# EAGLE schematic moist_probe_conv_0.1 (EAGLE 7.4.0)
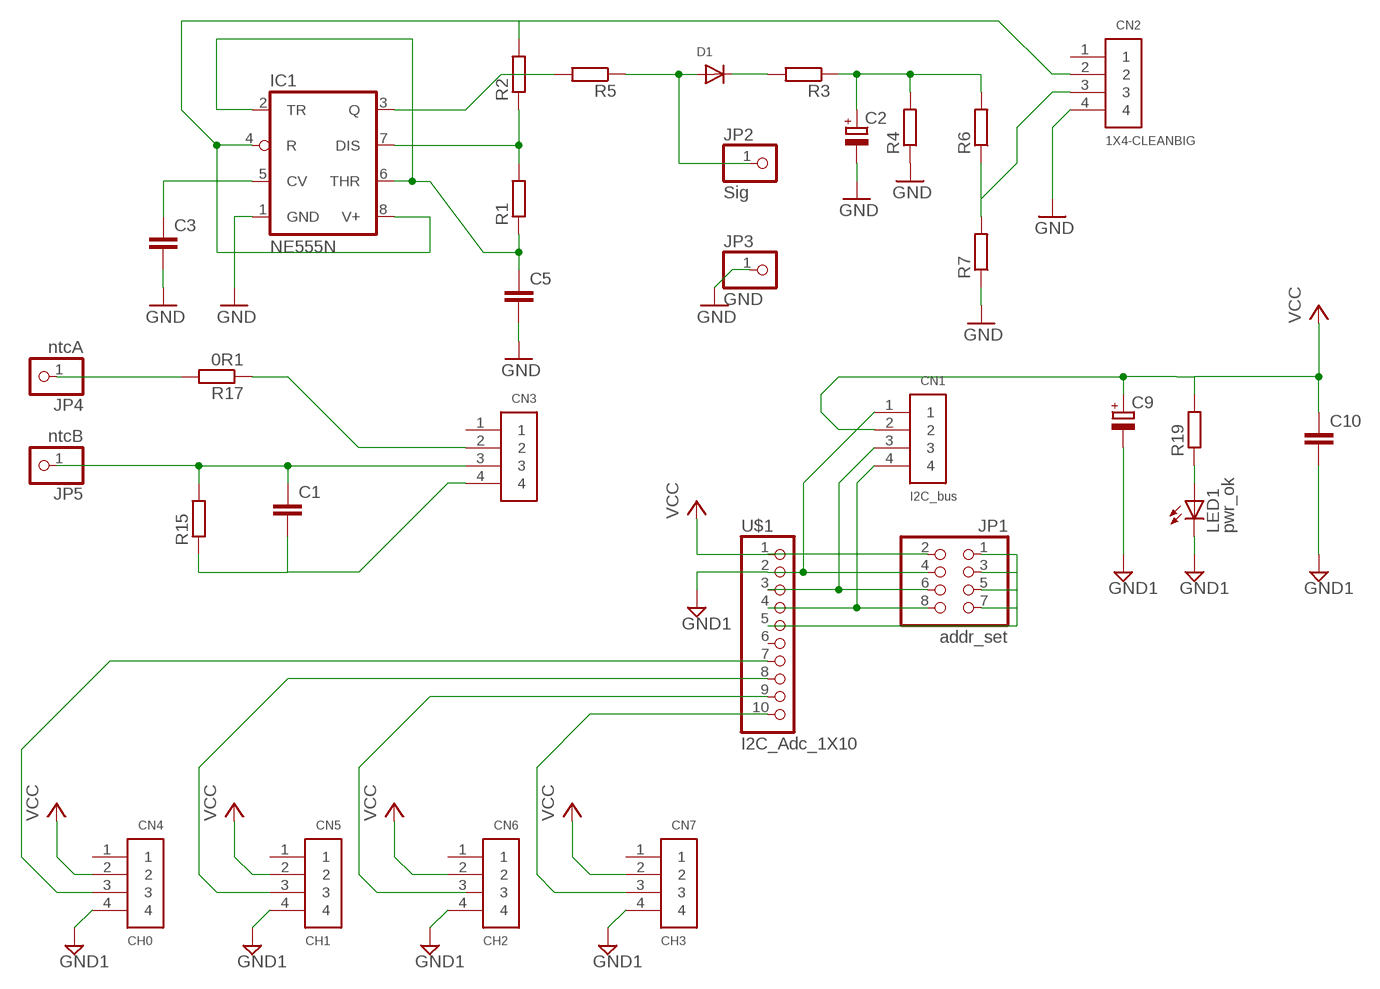
[diagram p0: schematic, sheet 1]

## Parts
C1  C-EU050-025X075  [C050-025X075]
C2  CPOL-EUE2,5-6E  [E2,5-6E]
C3  C-EU025-025X050  [C025-025X050]
C5  C-EU050-025X075  [C050-025X075]
C9  CPOL-EUE2.5-7  [E2,5-7]
C10  C-EU050-025X075  [C050-025X075]
CN1  I2C_bus  1X4-CLEANBIG  [1X04-CLEANBIG]
CN2  1X4-CLEANBIG  [1X04-CLEANBIG]
CN3  1X4-CLEANBIG  [1X04-CLEANBIG]
CN4  CH0  1X4-CLEANBIG  [1X04-CLEANBIG]
CN5  CH1  1X4-CLEANBIG  [1X04-CLEANBIG]
CN6  CH2  1X4-CLEANBIG  [1X04-CLEANBIG]
CN7  CH3  1X4-CLEANBIG  [1X04-CLEANBIG]
D1  DIODEDO-1N4148  [DO-1N4148]
IC1  NE555N  [DIL08-ROUND]
JP1  addr_set  PINHD-2X4  [2X04]
JP2  Sig  PINHD-1X1  [1X01]
JP3  GND  PINHD-1X1  [1X01]
JP4  ntcA  PINHD-1X1  [1X01]
JP5  ntcB  PINHD-1X1  [1X01]
LED1  pwr_ok  LED3MM  [LED3MM]
R1  R-EU_0204/2V  [0204V]
R2  R-EU_0204/2V  [0204V]
R3  R-EU_0204/2V  [0204V]
R4  R-EU_0204/2V  [0204V]
R5  R-EU_0204/7  [0204/7]
R6  R-EU_0204/2V  [0204V]
R7  R-EU_0204/2V  [0204V]
R15  R-EU_0204/7  [0204/7]
R17  0R1  R-EU_0204/7  [0204/7]
R19  R-EU_0204/2V  [0204V]
U$1  I2C_Adc_1X10  PINHD-1X10  [1X10-BIG]

## Nets
GND: C2.- C3.2 C5.2 CN2.4 IC1.1(GND) JP3.1 R4.1 R7.1
GND1: C9.- C10.2 CN1.1 CN4.4 CN5.4 CN6.4 CN7.4 JP1.4 LED1.K(C) U$1.2
N$1: CN1.3 JP1.6 U$1.3
N$2: C3.1 IC1.5(CV)
N$3: C5.1 IC1.2(TR) IC1.6(THR) R1.1
N$4: IC1.7(DIS) R1.2 R2.1
N$5: CN2.3 R6.1 R7.2
N$6: CN3.2 R17.1
N$7: D1.C R3.2
N$9: D1.A JP2.1 R5.1
N$10: IC1.3(Q) R5.2
N$11: C1.2 CN3.4 R15.1
N$12: C2.+ R3.1 R4.2 R6.2
N$14: CN7.3 U$1.10
N$15: U$1.9
N$16: CN5.3 U$1.8
N$17: CN4.3 U$1.7
N$18: CN1.4 JP1.8 U$1.4
N$19: C9.+ CN1.2
N$21: C1.1 CN3.3 JP5.1 R15.2
N$22: LED1.A R19.1
N$26: JP4.1 R17.2
N$28: JP1.1 JP1.3 JP1.5 JP1.7 U$1.5
N$32: CN2.2 IC1.4(R) IC1.8(V+) R2.2
VCC: C10.1 CN4.2 CN5.2 CN6.2 CN7.2 JP1.2 R19.2 U$1.1
Unconnected: CN2.1 CN3.1 CN4.1 CN5.1 CN6.1 CN6.3 CN7.1 U$1.6

## Library data of the parts
C1 C3 C5 C10 = rcl:C-EU: CAPACITOR, European symbol
C2 C9 = rcl:CPOL-EU: POLARIZED CAPACITOR, European symbol
CN1-CN7 = adafruit:1X4: 4-pin connector
D1 = adafruit:DIODE: Diode SMADIODE - SMA Surface Mount Package 20V 1A Schottky Diode Digikey: 641-1014-6-ND DO-1N4148 - Through Hole Small Current Diode SOD-123 20V 1 A (.5mV Vf) Schottky Diode - Digikey: MBRX120TPMSCT-ND SOD-323 10V 570mA (.38mV Vf, 3ns) Schottky Diode - Digikey: ZLLS410CT-ND SOD-523 30V 30mA Schottky Diode (RB751S-40TE61) - Digikey: RB751S-40TE61CT-ND SOT23-R/W - SOT23 Package (R = Solder Paste/Reflow Ovens, W = Hand-Soldering) BAT54Film 40V 300mA - Digikey: 497-7162-1-ND
IC1 = adafruit:*555: TIMER Changed DIP package to have round (not oval) pin pads http://www.ladyada.net/library/pcb/eaglelibrary.html
JP1 = adafruit:PINHD-2X4: PIN HEADER
JP2-JP5 = adafruit:PINHD-1X1: Pin header 1x1 for 0.1" spacing With round pins
LED1 = adafruit:LED: LED OSRAM: - CHIPLED LG R971, LG N971, LY N971, LG Q971, LY Q971, LO R971, LY R971 LH N974, LH R974 LS Q976, LO Q976, LY Q976 LO Q996 - Hyper CHIPLED LW Q18S LB Q993, LB Q99A, LB R99A - SideLED LS A670, LO A670, LY A670, LG A670, LP A670 LB A673, LV A673, LT A673, LW A673 LH A674 LY A675 LS A676, LA A676, LO A676, LY A676, LW A676 LS A679, LY A679, LG A679 - Hyper Micro SIDELED® LS Y876, LA Y876, LO Y876, LY Y876 LT Y87S - SmartLED LW L88C, LW L88S LB L89C, LB L89S, LG L890 LS L89K, LO L89K, LY L89K LS L896, LA L896, LO L896, LY L896 - TOPLED LS T670, LO T670, LY T670, LG T670, LP T670 LSG T670, LSP T670, LSY T670, LOP T670, LYG T670 LG T671, LOG T671, LSG T671 LB T673, LV T673, LT T673, LW T673 LH T674 LS T676, LA T676, LO T676, LY T676, LB T676, LH T676, LSB T676, LW T676 LB T67C, LV T67C, LT T67C, LS T67K, LO T67K, LY T67K, LW E67C LS E67B, LA E67B, LO E67B, LY E67B, LB E67C, LV E67C, LT E67C LW T67C LS T679, LY T679, LG T679 LS T770, LO T770, LY T770, LG T770, LP T770 LB T773, LV T773, LT T773, LW T773 LH T774 LS E675, LA E675, LY E675, LS T675 LS T776, LA T776, LO T776, LY T776, LB T776 LHGB T686 LT T68C, LB T68C - Hyper Mini TOPLED® LB M676 - Mini TOPLED Santana® LG M470 LS M47K, LO M47K, LY M47K Source: http://www.osram.convergy.de/
R1-R7 R15 R17 R19 = rcl:R-EU_: RESISTOR, European symbol
U$1 = adafruit:PINHD-1X10: Pin header 1x10 0.1" spacing With round pins